# EAGLE design card_adapter (EAGLE 9.2.1)
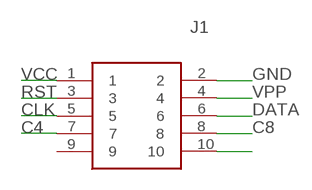
[diagram p0: schematic, sheet 1]

## Parts
J1  615008140121  [615008140121]

## Nets
C4: J1.7
C8: J1.8
CLK: J1.5
DATA: J1.6
GND: J1.2
N$10: J1.10
RST: J1.3
VCC: J1.1
VPP: J1.4
Unconnected: J1.9

## Library data of the parts
J1 = SamacSys_Parts:615008140121: Wurth Elektronik WR-MJ, 615008 Series Series Number Cat5 8 Way Horizontal PCB Mount STP RJ45 Modular Jack, Socket Source: Datasheet <https://componentsearchengine.com/Datasheets/1/615008140121.pdf>; DESCRIPTION: Wurth Elektronik WR-MJ, 615008 Series Series Number Cat5 8 Way Horizontal PCB Mount STP RJ45 Modular Jack, Socket; HEIGHT: 12mm; MANUFACTURER_NAME: Wurth Elektronik; MANUFACTURER_PART_NUMBER: 615008140121; MOUSER_PART_NUMBER: 710-615008140121

## Board
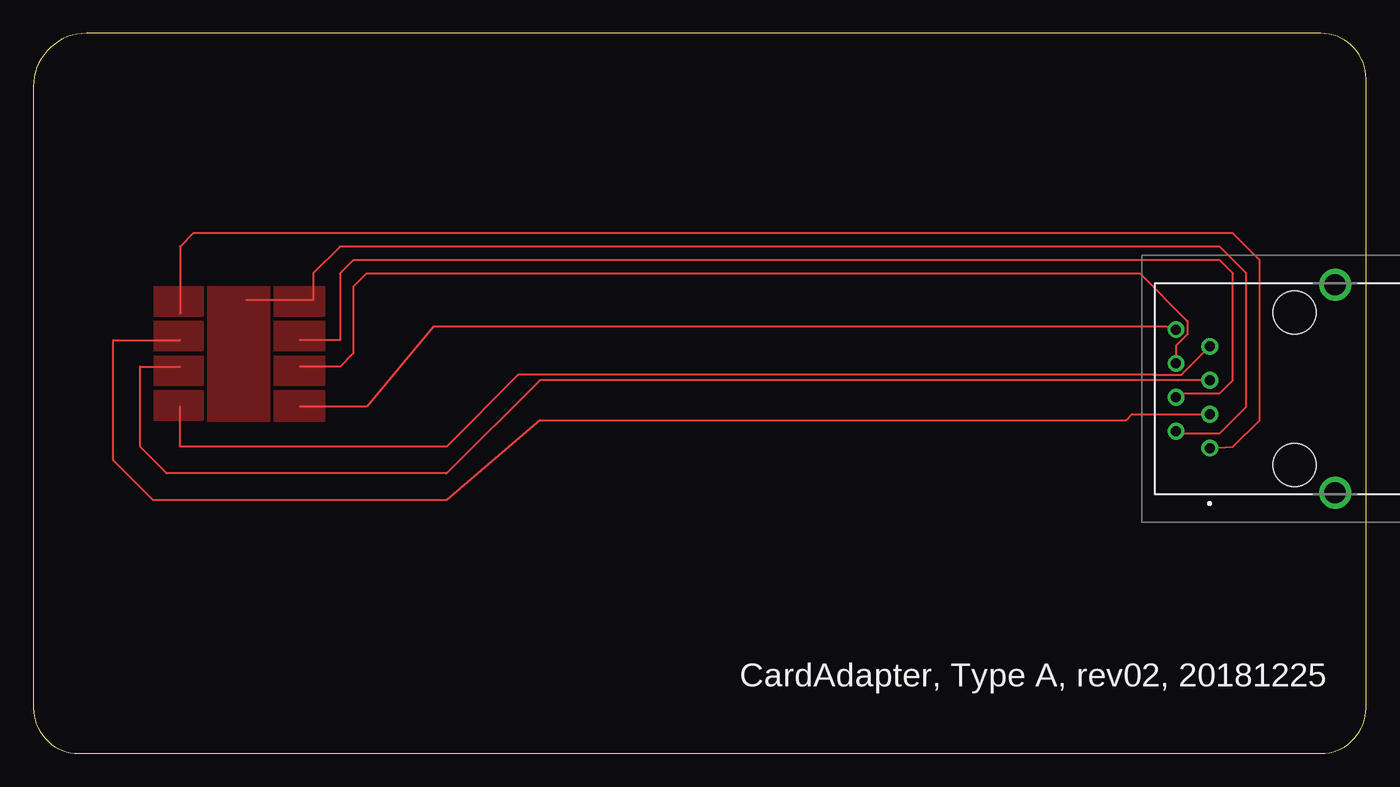
[diagram p1: board, top side]

Size 100 x 54 mm. Coordinates in mm from the lower left corner, seen from the top.
Outline: 0,50 0,3.41 arc90 3.41,0 96.59,0 arc90 100,3.41 100,50.59 arc90 96.59,54 4,54 arc90 0,50
Copper layers (1*16): Top 0.035mm / dielectric 1.5mm / Bottom 0.035mm
Design rules "NYAKARUHAZ_StandardNYAK": minimum track width 6mil, minimum drill 12mil, track to track 6mil, track to pad 6mil, pad to pad 6mil, via to via 6mil, smd to smd 6mil, copper to edge 20mil, drill to drill 8mil, minimum pad ring 10mil, minimum via ring 8mil, stop-mask expansion 4mil, vias tented up to drill 0mil, thermal gap 6mil

### Footprints (pad centres in the part's own frame; a part is rotated, then mirrored left to right if it is on the bottom)
615008140121 = drill 0.75 pad 1.2: 1 -4.445,5.23; 2 -3.175,7.77; 3 -1.905,5.23; 4 -0.635,7.77; 5 0.635,5.23; 6 1.905,7.77; 7 3.175,5.23; 8 4.445,7.77 | drill 1.6 pad 2.4: 9 -7.8,-4.17; 10 7.8,-4.17 | hole 3.25: -5.715,-1.12; 5.715,-1.12

### Placement (x,y rotation side)
J1  93.5,27.34 90 top

### Tracks (layer width: path | path; a pad name or v marks a point on that pad's centre or on a via)
C4
  Top 0.152: 11,26 11,23 31,23 36.39,28.39 84,28.39 84.27,28.39 86.14,28.39 J1.7
  pour Top: 9.1,27.2 12.7,27.2 12.7,25 9.1,25
C8
  Top 0.152: J1.8 85,32 30,32 25,26 20,26
  pour Top: 21.8,27.2 21.8,24.9 18.1,24.9 18.1,27.2
CLK
  Top 0.152: J1.5 85.84,27.98 85.81,28 38,28 31,21 10,21 8,23 8,29 11,29
  pour Top: 9.1,29.8 12.7,29.8 12.7,27.6 9.1,27.6
DATA
  Top 0.152: 20,29 23,29 24,30 24,35 25,36 83,36 86.59,32.41 86.59,31.43 85.73,30.57 J1.6
  pour Top: 18.1,29.8 21.8,29.8 21.8,27.6 18.1,27.6
GND
  Top 0.152: J1.2 86,24 89,24 91,26 91,36 89,38 23,38 21,36 21,34 16,34
  pour Top: 18.1,35 21.8,35 21.8,32.8 18.1,32.8
  pour Top: 13.1,35 17.7,35 17.7,24.9 13.1,24.9
RST
  Top 0.152: 11,31 6,31 6,22 9,19 31,19 38,25 82,25 82.44,25.43 J1.3
  pour Top: 9.1,32.4 12.7,32.4 12.7,30.2 9.1,30.2
VCC
  Top 0.152: J1.1 90,23 92,25 92,37 90,39 12,39 11,38 11,33
  pour Top: 9.1,35 12.7,35 12.7,32.8 9.1,32.8
VPP
  Top 0.152: J1.4 86.03,27 89,27 90,28 90,36 89,37 24,37 23,36 23,31 20,31
  pour Top: 18.1,32.4 21.8,32.4 21.8,30.2 18.1,30.2

### Text on the board
tNames: CardAdapter, Type A, rev02, 20181225